# Altium schematic sheet Nixie Valve Clock Power Supply Daughterboard.SchDoc
size A4; SheetNumber: 1; SheetTotal: 3
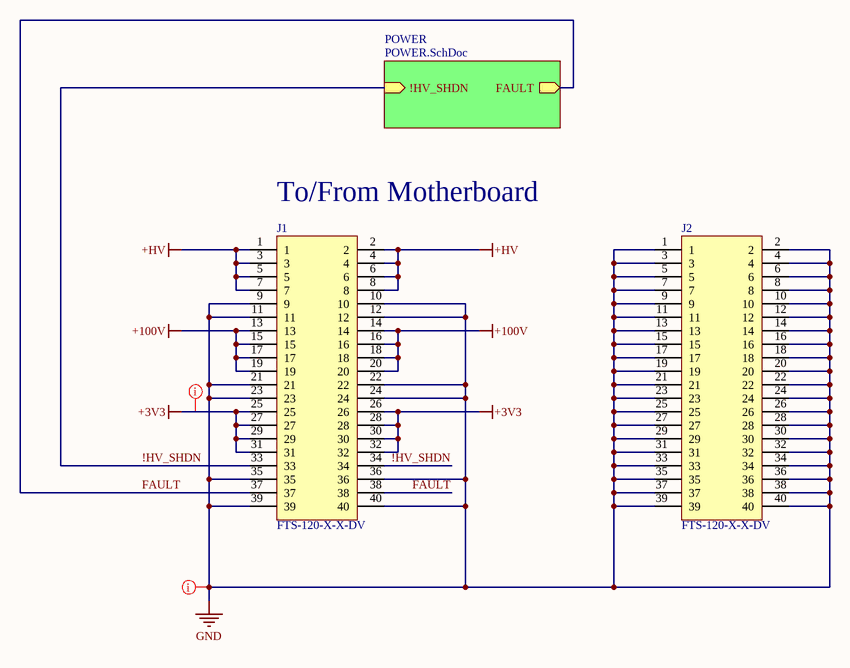
[diagram p0: Nixie Valve Clock Power Supply Daughterboard.SchDoc]

## Parts
?  (no value)
J1  FTS-120-X-X-DV  [SAMTEC_FTS-120-X-X-DV]
J2  FTS-120-X-X-DV  [SAMTEC_FTS-120-X-X-DV]

## Sub-sheets
POWER = POWER.SchDoc: !HV_SHDN (in), FAULT (out)

## Nets
+3V3: J1.25 J1.26 J1.27 J1.28 J1.29 J1.30 J1.31 J1.32
+100V: J1.13 J1.14 J1.15 J1.16 J1.17 J1.18 J1.19 J1.20
+HV: J1.1 J1.2 J1.3 J1.4 J1.5 J1.6 J1.7 J1.8
GND: J1.9 J1.10 J1.11 J1.12 J1.21 J1.22 J1.23 J1.24 J1.35 J1.36 J1.39 J1.40 J2.1 J2.2 J2.3 J2.4 J2.5 J2.6 J2.7 J2.8 J2.9 J2.10 J2.11 J2.12 J2.13 J2.14 J2.15 J2.16 J2.17 J2.18 J2.19 J2.20 J2.21 J2.22 J2.23 J2.24 J2.25 J2.26 J2.27 J2.28 J2.29 J2.30 J2.31 J2.32 J2.33 J2.34 J2.35 J2.36 J2.37 J2.38 J2.39 J2.40
!HV_SHDN: J1.33 J1.34 ; sheet POWER/!HV_SHDN
FAULT: J1.37 J1.38 ; sheet POWER/FAULT

## Layout directives
net class POWER: +3V3, GND

## Notes on the sheet
- (near J1) To/From Motherboard
- Project:
- Designer:
- Sheet
- of
- Filename:

## Library data of the parts
? = CMP-00003-4: The KETS Schematic Sheet Title Block
J1 J2 = CMP-002-00205-3: Pin Header, Board-to-Board, 1.27 mm, 2 Rows, 40 Contacts, Surface Mount, FTS Series; Manufacturer Lifecycle Status: PRODUCTION; Gender: Male; MP: FTS-120-02-L-DV; MF: Samtec; Current Rating: 1.75A; Pitch: 1.27mm; Number of Contacts: 40; Pins: 40; Design Item ID: FTS-120-X-X-DV; Case/Package: None; Mounting Technology: Surface Mount; Check_prices: https://www.snapeda.com/parts/FTS-120-04-G-DV-P/Samtec/view-part/?ref=eda; Source: FTS-120-X-X-DV.SchLib; Value: *; Component Type: Standard; Min Operating Temperature: -55°C; Max Operating Temperature: 125°C; SnapEDA_Link: https://www.snapeda.com/parts/FTS-120-04-G-DV-P/Samtec/view-part/?ref=snap; Termination: Solder; Lifecycle Status: Production; Housing Material: Polymer; Housing Color: Black; Number of Rows: 2; RoHS: Compliant; Contact Material: Bronze; Orientation: Straight; REACH SVHC: No; Depth: 3.42mm; Length: 25.4mm; Contact Plating: Gold